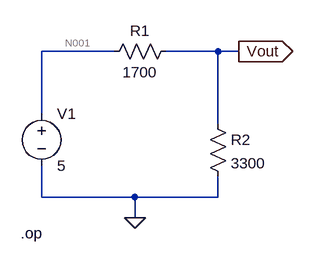
[diagram p0: schematic DC_operating_point_to_test_dc_output.asc]
DC_operating_point_to_test_dc_output.asc, the LTspice schematic file:
Version 4
SHEET 1 880 680
WIRE -48 32 -160 32
WIRE 112 32 32 32
WIRE 144 32 112 32
WIRE -160 128 -160 32
WIRE 112 144 112 32
WIRE -160 256 -160 208
WIRE -16 256 -160 256
WIRE 112 256 112 224
WIRE 112 256 -16 256
WIRE -16 288 -16 256
FLAG -16 288 0
FLAG 144 32 Vout
IOPIN 144 32 Out
SYMBOL voltage -160 112 R0
WINDOW 123 0 0 Left 0
WINDOW 39 0 0 Left 0
SYMATTR InstName V1
SYMATTR Value 5
SYMBOL res 48 16 R90
WINDOW 0 0 56 VBottom 2
WINDOW 3 32 56 VTop 2
SYMATTR InstName R1
SYMATTR Value 1700
SYMBOL res 96 128 R0
SYMATTR InstName R2
SYMATTR Value 3300
TEXT -192 312 Left 2 !.op

The netlist it stands for:
* DC_operating_point_to_test_dc_output.asc
V1 N001 0 5
R1 Vout N001 1700
R2 Vout 0 3300
.op
.backanno
.end

* Results of the author's LTspice run, read from the files saved beside the schematic
* Operating Point:
*   V(n001) = 5 V
*   V(vout) = 3.3 V
*   I(R1) = -1 mA
*   I(R2) = 1 mA
*   I(V1) = -1 mA